# Altium schematic sheet Приставка преоб напряжений и интерфейсов.SchDoc: Название платы
size 594 x 420 mm; ApprovedBy: Рогов; CheckedBy: Фамилия проверяющего; DrawnBy: Фамилия разработчика; DocumentNumber: Введите номер платы + Э3; SheetNumber: пусто если листов 1, иначе 1; SheetTotal: количество листов; Format: A2; DocumentType: тип схемы; Title1str: (вторая строка при необходимости); ImagePath: Введите номер платы
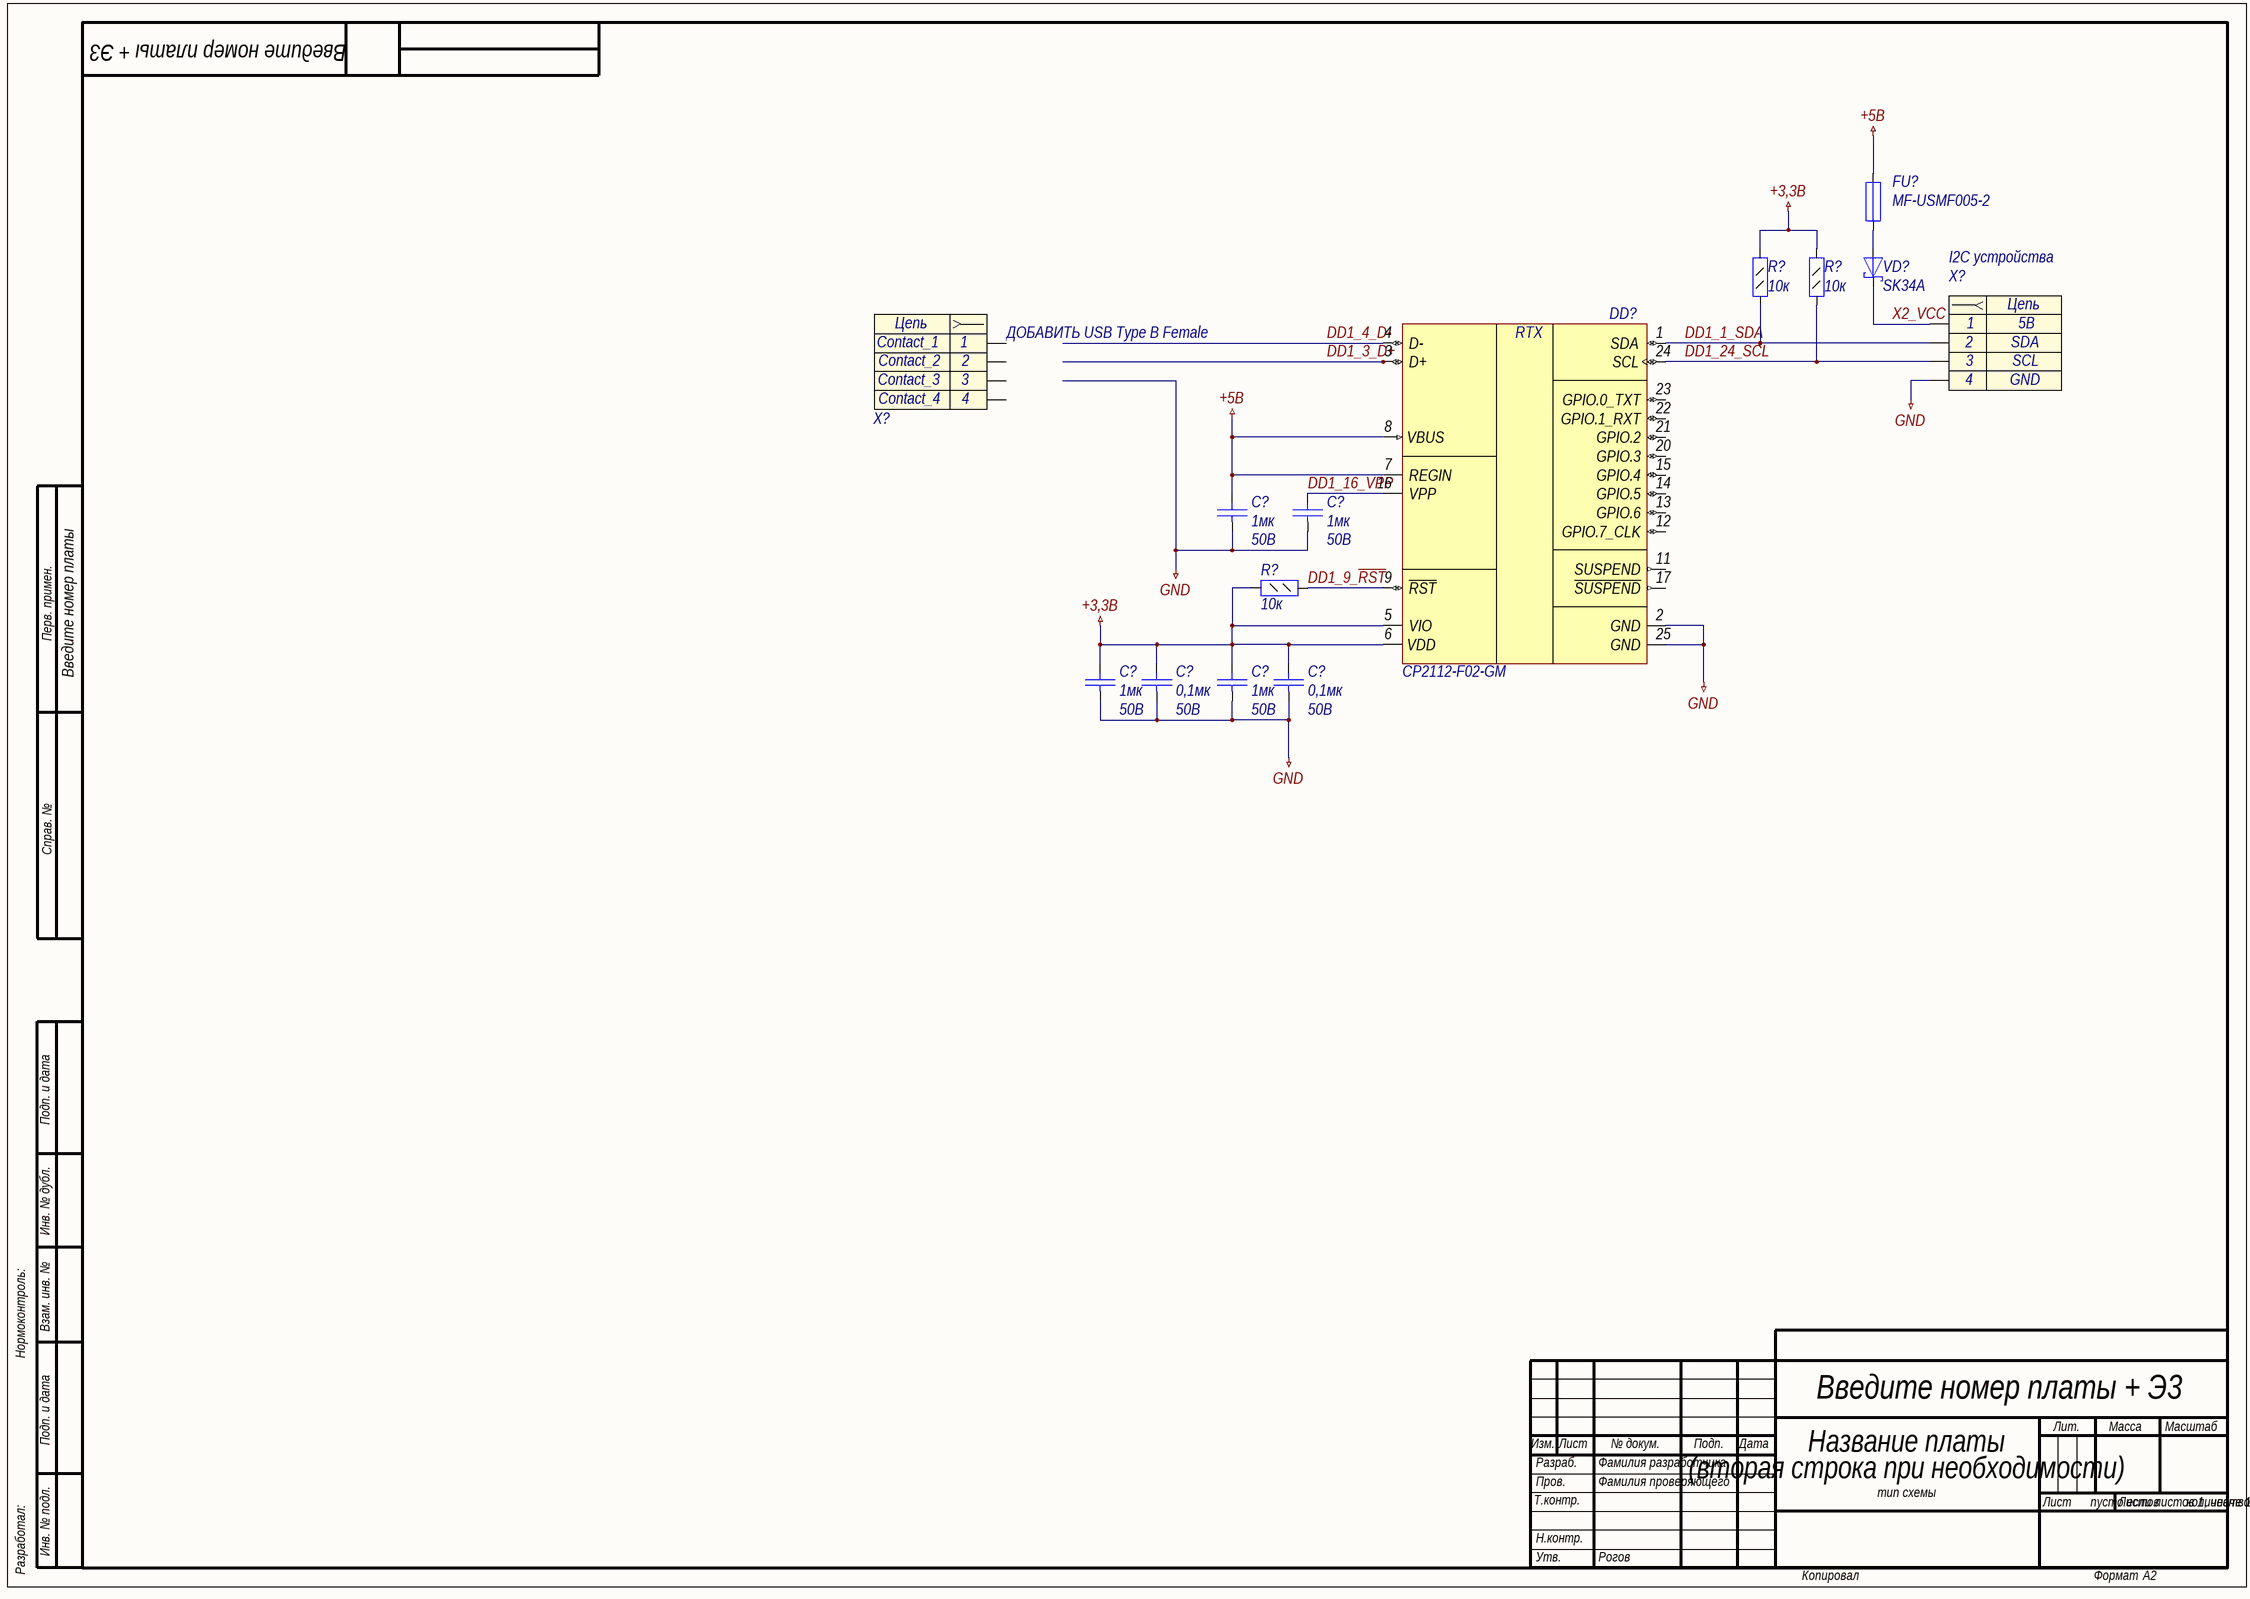
[diagram p0: Приставка преоб напряжений и интерфейсов.SchDoc]

## Parts
(Parts that share a designator on the sheet are numbered #1, #2 ... from top to bottom, then left to right.)
C?#1  value 1мк  Voltage: 50B  [C0603]  (hidden comment: Capacitor)
C?#2  value 1мк  Voltage: 50B  [C0603]  (hidden comment: Capacitor)
C?#3  value 1мк  Voltage: 50B  [C0603]  (hidden comment: Capacitor)
C?#4  value 0,1мк  Voltage: 50B  [C0603]  (hidden comment: Capacitor)
C?#5  value 1мк  Voltage: 50B  [C0603]  (hidden comment: Capacitor)
C?#6  value 0,1мк  Voltage: 50B  [C0603]  (hidden comment: Capacitor)
DD?  CP2112-F02-GM  [QFN24]
FU?  Part Number: MF-USMF005-2  [FUSE812]  (hidden comment: Fuse)
R?#1  value 10к  [R0805]  (hidden comment: Resistor_0,125Вт)
R?#2  value 10к  [R0805]  (hidden comment: Resistor_0,125Вт)
R?#3  value 10к  [R0805]  (hidden comment: Resistor_0,125Вт)
VD?  Part Number: SK34A  [SMA]  (hidden comment: DiodeSchottky)
X?#1  Part Name: I2C устройства  [PLS-4HOLES]  (hidden comment: Header_4_sct)
X?#2  Header_4_sct  [USB-B RECEPTACLE]  (value not drawn)

## Nets
+3,3В: C?#3.2 C?#4.2 C?#5.2 C?#6.2 DD?.5(VIO) DD?.6(VDD) R?#1.2 R?#2.2 R?#3.2
+5В: C?#1.2 DD?.7(REGIN) DD?.8(VBUS) FU?.2
GND: C?#1.1 C?#2.1 C?#3.1 C?#4.1 C?#5.1 C?#6.1 DD?.2(GND) DD?.25(GND) X?#1.4
DD1_1_SDA: DD?.1(SDA) R?#1.1 X?#1.2
DD1_3_D+: DD?.3(D+)
DD1_4_D-: DD?.4(D-)
DD1_9_~{RST}: DD?.9(~{RST}) R?#3.1
DD1_16_VPP: C?#2.2 DD?.16(VPP)
DD1_24_SCL: DD?.24(SCL) R?#2.1 X?#1.3
X2_VCC: VD?.1(K) X?#1.1
NetFU?_1: FU?.1 VD?.2(A)

Not connected (* = marked no-connect by the designer): DD? 11(SUSPEND) 12(GPIO.7_CLK) 13(GPIO.6) 14(GPIO.5) 15(GPIO.4) 17(~{SUSPEND}) 20(GPIO.3) 21(GPIO.2) 22(GPIO.1_RXT) 23(GPIO.0_TXT); X?#2 1 2 3 4

## Notes on the sheet
- (near X?#2) ДОБАВИТЬ USB Type B Female
- Перв. примен.
- Справ. №
- Подп. и дата
- Инв. № дубл.
- Нормоконтроль:
- Взам. инв. №
- Изм.
- Лист
- № докум.
- Подп.
- Дата
- Лит.
- Масса
- Масштаб
- Т.контр.
- Пров.
- Разраб.
- Листов
- Разработал:
- Инв. № подл.
- Н.контр.
- Утв.
- Копировал
- Формат
- (in symbol connect10) Цепь
- (in symbol connect38) Цепь
- (in symbol interf14) RTX

## Library data of the parts
C?#1-C?#3 C?#5 = cap134: Конденсатор; Part Name: Capacitors; Part Number: GRM188R71C105KA12D**; id: cap134; TKE: X7R
C?#4 C?#6 = cap131: Конденсатор; Part Name: Capacitors; Part Number: GRM188R71H104K; id: cap131; TKE: X7R
DD? = interf14: USB-I2C преобразователь; Part Name: HID USB to SMBUS Bridge; Manufacture: Silicon Laboratories; Vref output: 3.45V; Type Supply: Single Polar; Current Consumption: 15mA; Power Supply: 3.0-3.6V; id: interf14; Part Number: CP2112-F02-GM
FU? = fuse20: Предохранитель; Part Name: Resettable Fuses; Manufacture: Bourns; id: fuse20; V max: 30B; I max: 10A; I hold: 0,05A; I trip: 0,15A; Resistance: 2,8Ohms
R?#1-R?#3 = res97: Резистор; Manufacture: Yageo; Part Number: RC0805FR-0710KL; id: res97; Accuracy: 1%; Part Name: Resistor; Power: 0,125Вт
VD? = diode2: Диод Шоттки; Manufacture: Taiwan Semiconductor; id: diode2; Reverse Voltage: 40B; Forward Voltage: 0,55B; Forward Current: 3A; Part Name: Diode Schottky
X?#1 = connect10: Разъем - 4 конт. розетка; Contact_1: 5В; Contact_2: SDA; Contact_3: SCL; Contact_4: GND; id: connect10
X?#2 = connect38: Разъем - 4 конт. розетка; Part Name: USB 2.0 B Receptacle; Part Number: UJ2-BH-W2-TH; Manufacture: CUI; Etch: 10,8mm; Contact_1: Contact_1; Contact_2: Contact_2; Contact_3: Contact_3; Contact_4: Contact_4; id: connect38